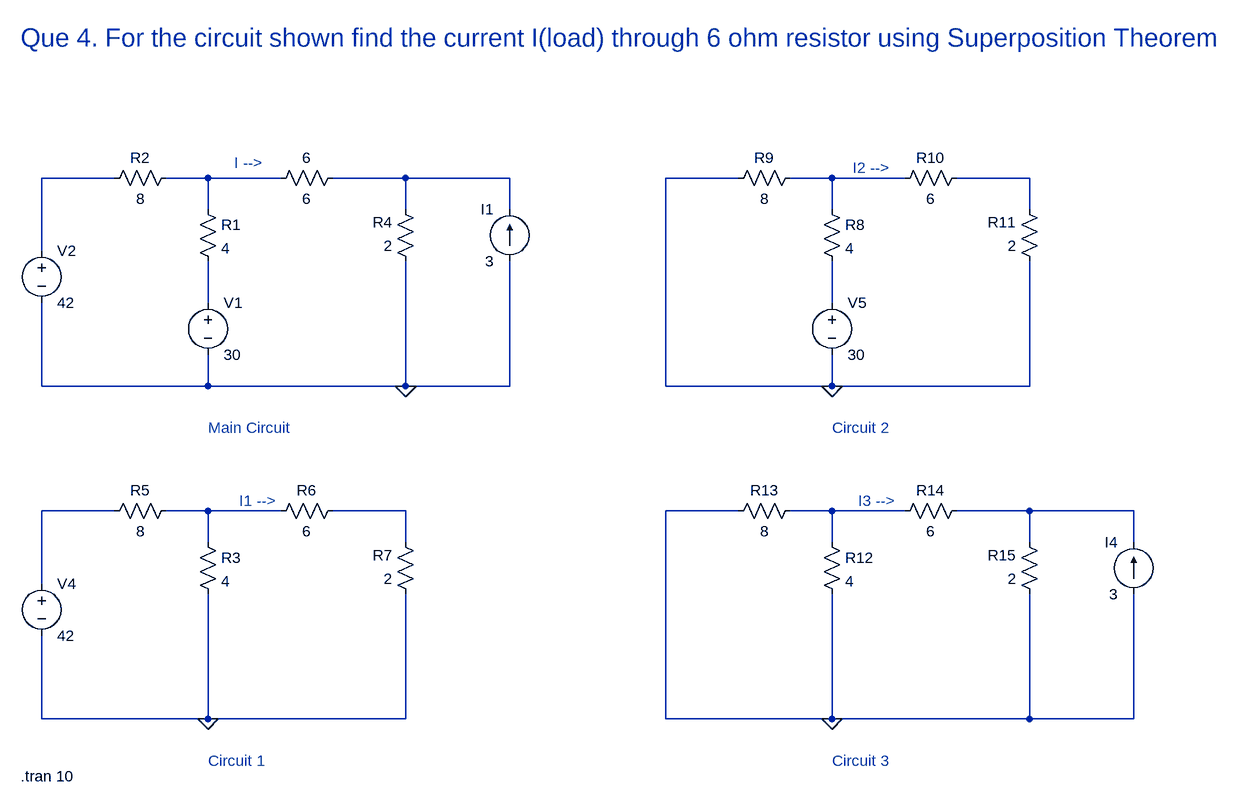
[diagram p0: schematic 4_Dheerendra_23EE019_Superposition_4.asc]
4_Dheerendra_23EE019_Superposition_4.asc, the LTspice schematic file:
Version 4
SHEET 1 1736 1224
WIRE -160 288 -272 288
WIRE -16 288 -80 288
WIRE 96 288 -16 288
WIRE 288 288 176 288
WIRE 448 288 288 288
WIRE 800 288 688 288
WIRE 944 288 880 288
WIRE 1056 288 944 288
WIRE 1248 288 1136 288
WIRE -16 336 -16 288
WIRE 288 336 288 288
WIRE 448 336 448 288
WIRE 944 336 944 288
WIRE 1248 336 1248 288
WIRE -272 400 -272 288
WIRE -16 480 -16 416
WIRE 944 480 944 416
WIRE -272 608 -272 480
WIRE -16 608 -16 560
WIRE -16 608 -272 608
WIRE 288 608 288 416
WIRE 288 608 -16 608
WIRE 448 608 448 416
WIRE 448 608 288 608
WIRE 688 608 688 288
WIRE 944 608 944 560
WIRE 944 608 688 608
WIRE 1248 608 1248 416
WIRE 1248 608 944 608
WIRE -160 800 -272 800
WIRE -16 800 -80 800
WIRE 96 800 -16 800
WIRE 288 800 176 800
WIRE 800 800 688 800
WIRE 944 800 880 800
WIRE 1056 800 944 800
WIRE 1248 800 1136 800
WIRE 1408 800 1248 800
WIRE -16 848 -16 800
WIRE 288 848 288 800
WIRE 944 848 944 800
WIRE 1248 848 1248 800
WIRE 1408 848 1408 800
WIRE -272 912 -272 800
WIRE -272 1120 -272 992
WIRE -16 1120 -16 928
WIRE -16 1120 -272 1120
WIRE 288 1120 288 928
WIRE 288 1120 -16 1120
WIRE 688 1120 688 800
WIRE 944 1120 944 928
WIRE 944 1120 688 1120
WIRE 1248 1120 1248 928
WIRE 1248 1120 944 1120
WIRE 1408 1120 1408 928
WIRE 1408 1120 1248 1120
FLAG 288 608 0
FLAG 944 608 0
FLAG -16 1120 0
FLAG 944 1120 0
SYMBOL res -32 320 R0
SYMATTR InstName R1
SYMATTR Value 4
SYMBOL res -64 272 R90
WINDOW 0 0 56 VBottom 2
WINDOW 3 32 56 VTop 2
SYMATTR InstName R2
SYMATTR Value 8
SYMBOL res 192 272 R90
WINDOW 0 0 56 VBottom 2
WINDOW 3 32 56 VTop 2
SYMATTR InstName 6
SYMATTR Value 6
SYMBOL res 304 432 R180
WINDOW 0 36 76 Left 2
WINDOW 3 36 40 Left 2
SYMATTR InstName R4
SYMATTR Value 2
SYMBOL current 448 416 R180
WINDOW 0 24 80 Left 2
WINDOW 3 24 0 Left 2
WINDOW 123 0 0 Left 0
WINDOW 39 0 0 Left 0
SYMATTR InstName I1
SYMATTR Value 3
SYMBOL voltage -16 464 R0
WINDOW 123 0 0 Left 0
WINDOW 39 0 0 Left 0
SYMATTR InstName V1
SYMATTR Value 30
SYMBOL voltage -272 384 R0
WINDOW 123 0 0 Left 0
WINDOW 39 0 0 Left 0
SYMATTR InstName V2
SYMATTR Value 42
SYMBOL res -32 832 R0
SYMATTR InstName R3
SYMATTR Value 4
SYMBOL res -64 784 R90
WINDOW 0 0 56 VBottom 2
WINDOW 3 32 56 VTop 2
SYMATTR InstName R5
SYMATTR Value 8
SYMBOL res 192 784 R90
WINDOW 0 0 56 VBottom 2
WINDOW 3 32 56 VTop 2
SYMATTR InstName R6
SYMATTR Value 6
SYMBOL res 304 944 R180
WINDOW 0 36 76 Left 2
WINDOW 3 36 40 Left 2
SYMATTR InstName R7
SYMATTR Value 2
SYMBOL voltage -272 896 R0
WINDOW 123 0 0 Left 0
WINDOW 39 0 0 Left 0
SYMATTR InstName V4
SYMATTR Value 42
SYMBOL res 928 320 R0
SYMATTR InstName R8
SYMATTR Value 4
SYMBOL res 896 272 R90
WINDOW 0 0 56 VBottom 2
WINDOW 3 32 56 VTop 2
SYMATTR InstName R9
SYMATTR Value 8
SYMBOL res 1152 272 R90
WINDOW 0 0 56 VBottom 2
WINDOW 3 32 56 VTop 2
SYMATTR InstName R10
SYMATTR Value 6
SYMBOL res 1264 432 R180
WINDOW 0 36 76 Left 2
WINDOW 3 36 40 Left 2
SYMATTR InstName R11
SYMATTR Value 2
SYMBOL voltage 944 464 R0
WINDOW 123 0 0 Left 0
WINDOW 39 0 0 Left 0
SYMATTR InstName V5
SYMATTR Value 30
SYMBOL res 928 832 R0
SYMATTR InstName R12
SYMATTR Value 4
SYMBOL res 896 784 R90
WINDOW 0 0 56 VBottom 2
WINDOW 3 32 56 VTop 2
SYMATTR InstName R13
SYMATTR Value 8
SYMBOL res 1152 784 R90
WINDOW 0 0 56 VBottom 2
WINDOW 3 32 56 VTop 2
SYMATTR InstName R14
SYMATTR Value 6
SYMBOL res 1264 944 R180
WINDOW 0 36 76 Left 2
WINDOW 3 36 40 Left 2
SYMATTR InstName R15
SYMATTR Value 2
SYMBOL current 1408 928 R180
WINDOW 0 24 80 Left 2
WINDOW 3 24 0 Left 2
WINDOW 123 0 0 Left 0
WINDOW 39 0 0 Left 0
SYMATTR InstName I4
SYMATTR Value 3
TEXT -304 72 Left 4 ;Que 4. For the circuit shown find the current I(load) through 6 ohm resistor using Superposition Theorem
TEXT -16 672 Left 2 ;Main Circuit
TEXT -16 1184 Left 2 ;Circuit 1
TEXT 944 672 Left 2 ;Circuit 2
TEXT 944 1184 Left 2 ;Circuit 3
TEXT -304 1208 Left 2 !.tran 10
TEXT 24 264 Left 2 ;I -->
TEXT 32 784 Left 2 ;I1 -->
TEXT 976 272 Left 2 ;I2 -->
TEXT 984 784 Left 2 ;I3 -->

The netlist it stands for:
* 4_Dheerendra_23EE019_Superposition_4.asc
R1 N002 N006 4
R2 N002 N001 8
R§6 N003 N002 6
R4 0 N003 2
I1 0 N003 3
V1 N006 0 30
V2 N001 0 42
R3 N009 0 4
R5 N009 N008 8
R6 N010 N009 6
R7 0 N010 2
V4 N008 0 42
R8 N004 N007 4
R9 N004 0 8
R10 N005 N004 6
R11 0 N005 2
V5 N007 0 30
R12 N011 0 4
R13 N011 0 8
R14 N012 N011 6
R15 0 N012 2
I4 0 N012 3
* Que 4. For the circuit shown find the current I(load) through 6 ohm resistor using Superposition Theorem
* Main Circuit
* Circuit 1
* Circuit 2
* Circuit 3
.tran 10
* I -->
* I1 -->
* I2 -->
* I3 -->
.backanno
.end